# Altium schematic sheet cs301_Group2_Sensing.SchDoc
size A4; SheetNumber: 2; SheetTotal: 3
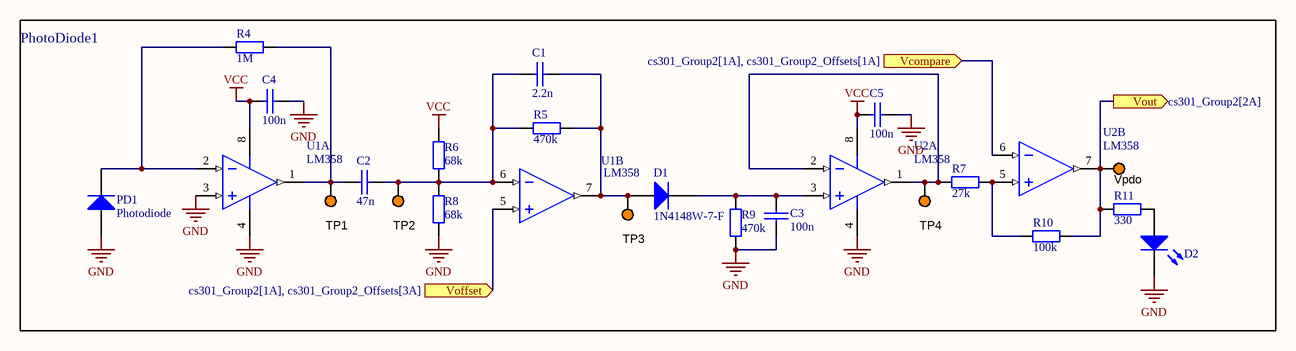
[diagram p0: cs301_Group2_Sensing.SchDoc]

## Parts
C1  2.2n  [0805 CAP]
C2  47n  [0805 CAP]
C3  100n  [0805 CAP]
C4  100n  [0805 CAP]
C5  100n  [0805 CAP]
D1  1N4148W-7-F  [SOD123]
D2  LTST-C170KGKT  [0805 LED]  (value not drawn)
PD1  Photodiode  [SOD123]
R4  1M  [0805 RES]
R5  470k  [0805 RES]
R6  68k  [0805 RES]
R7  27k  [0805 RES]
R8  68k  [0805 RES]
R9  470k  [0805 RES]
R10  100k  [0805 RES]
R11  330  [0805 RES]
TP1  5003  [TP_TH]  (value not drawn)
TP2  5003  [TP_TH]  (value not drawn)
TP3  5003  [TP_TH]  (value not drawn)
TP4  5003  [TP_TH]  (value not drawn)
U1  LM358  [SO - 8]  (parts A,B of 2)
U2  LM358  [SO - 8]  (parts A,B of 2)
Vpdo  5003  [TP_TH]  (value not drawn)

## Blocks framed on the sheet
PhotoDiode1: C1-C5 D1 D2 PD1 R4-R11 TP1-TP4 U1 U2 Vpdo

## Ports
Vcompare (in, see cs301_Group2[1A], cs301_Group2_Offsets[1A]), Voffset (in, see cs301_Group2[1A], cs301_Group2_Offsets[3A]), Vout (out, see cs301_Group2[2A])

## Nets
GND: C3.1 C4.2 C5.2 D2.2(K) PD1.1(A) R8.1 R9.1 U1.3(VINA+) U1.4(VSS) U2.4(VSS)
VCC: C4.1 C5.1 R6.2 U1.8(VDD) U2.8(VDD)
Vcompare: U2.6(VINA-) ; port Vcompare
Voffset: U1.5(VINA+) ; port Voffset
Vout: R10.1 R11.1 U2.7(VOUTA) Vpdo.1 ; port Vout
NetC1_1: C1.1 C2.2 R5.2 R6.1 R8.2 TP2.1 U1.6(VINA-)
NetC1_2: C1.2 D1.1(A) R5.1 TP3.1 U1.7(VOUTA)
NetC2_1: C2.1 R4.1 TP1.1 U1.1(VOUTA)
NetC3_2: C3.2 D1.2(K) R9.2 U2.3(VINA+)
NetD2_1: D2.1(A) R11.2
NetPD1_2: PD1.2(K) R4.2 U1.2(VINA-)
NetR7_1: R7.1 R10.2 U2.5(VINA+)
NetR7_2: R7.2 TP4.1 U2.1(VOUTA) U2.2(VINA-)

## Library data of the parts
C1-C5 = CerCap_SMT_0805: SMT ceramic capacitor 0805 size; Value: *
D1 = ES1H_SMT_DO214: 1N4148 100V 200mA SOD-123 diode; Manufacturer: ON Semiconductor; Manufacturer Part Number: 1N4148TR; Diode Type: Standard; Speed: Small Signal =< 200mA (Io), Any Speed; Capacitance @ Vr, F: 4pF @ 0V, 1MHz; Supplier 1: Digi-Key; RoHS: RoHS Compliant; Category: Discrete Semiconductor Products; Stock 1: 1658049; Pricing 1: 1=0.16, 10=0.109, 100=0.0592, 500=0.03648, 1000=0.02488 (NZD); Part Status: Active; Current - Average Rectified (Io): 200mA; Mounting Type: Through Hole; Package / Case: DO-204AH, DO-35, Axial; Supplier Device Package: DO-35; Operating Temperature - Junction: -65°C ~ 175°C; Base Part Number: 1N4148; ComponentLink1URL: https://www.fairchildsemi.com/datasheets/1N/1N914.pdf; ComponentLink1Description: https://www.fairchildsemi.com/datasheets/1N/1N914.pdf; Supplier Part Number 1: 1N4148FSCT-ND
D2 = LED_SMT_0805: SMT LED 0805 size; Manufacturer: Lite-On Inc.; Color: Green; Lens Color: Colorless; Lens Transparency: Clear; Millicandela Rating: 35mcd; Lens Style/Size: Rectangle with Flat Top, 1.40mm x 1.25mm; Voltage - Forward (Vf) (Typ): 2V; Current - Test: 20mA; Viewing Angle: 130°; Wavelength - Dominant: 571nm; Wavelength - Peak: 574nm; Supplier 1: Digi-Key; Manufacturer Part Number: LTST-C170KGKT; RoHS: RoHS Compliant; Category: Optoelectronics; Stock 1: 503069; Pricing 1: 1=0.62, 10=0.459, 25=0.338, 100=0.2415, 250=0.16416, 500=0.14486, 1000=0.11347 (NZD); Packaging: Cut Tape (CT); Part Status: Active; Mounting Type: Surface Mount; Features: -; Package / Case: 0805 (2012 Metric); Size / Dimension: 2.00mm L x 1.25mm W; Height (Max): 1.10mm; ComponentLink1URL: http://optoelectronics.liteon.com/upload/download/DS22-2000-073/LTST-C170KGKT.pdf; ComponentLink1Description: http://optoelectronics.liteon.com/upload/download/DS22-2000-073/LTST-C170KGKT.pdf; Supplier Part Number 1: 160-1414-1-ND
PD1 = 1N4148_SMT_SOD123: DIODE GEN PURP 100V 300MA SOD123; Manufacturer: Diodes Incorporated; Manufacturer Part Number: 1N4148W-13-F; Diode Type: Standard; Current - Average Rectified (Io): 150mA; Speed: Small Signal =< 200mA (Io), Any Speed; Capacitance @ Vr, F: 2pF @ 0V, 1MHz; Supplier 1: Digi-Key; RoHS: RoHS Compliant; Category: Discrete Semiconductor Products; Stock 1: 5282; Pricing 1: 1=0.33, 10=0.292, 100=0.1586, 500=0.0976, 1000=0.06656 (NZD); Packaging: Cut Tape (CT); Part Status: Active; Mounting Type: Surface Mount; Package / Case: SOD-123; Supplier Device Package: SOD-123; Operating Temperature - Junction: -65°C ~ 150°C; Base Part Number: 1N4148W; ComponentLink1URL: https://www.diodes.com/assets/Datasheets/ds30086.pdf; ComponentLink1Description: https://www.diodes.com/assets/Datasheets/ds30086.pdf; Supplier Part Number 1: 1N4148W-13FDICT-ND
R4-R11 = Res_SMT_0805: 0805 resistor; Published: 8-Jun-2000; LatestRevisionDate: 17-Jul-2002; LatestRevisionNote: Re-released for DXP Platform.; PackageReference: AXIAL-0.4; Publisher: Altium Limited; Value: *; ComponentLink1Description: https://nz.mouser.com/datasheet/2/315/AOA0000C304-1149620.pdf
TP1-TP4 Vpdo = TestPoint: Test Point, Orange, 1-Pin THD, RoHS; Peak Reverse Current: 600 uA; Forward Current: 3 A; Max Surge Current: 80 A; Forward Voltage: 1.08 V; Max Operating Temperature: 150 degC; PackageReference: 5003; Pins: 2; ComponentLink2URL: http://keyelco.com/userAssets/file/M65p56.pdf; PackageDescription: 1-Pin Through Hole Device, Dia 2.54 mm; Weight: 0.01 lb; Diameter: 5.3 mm; Mount: Through Hole; Package Quantity: 500; Packaging: Bulk; Min Operating Temperature: -65 degC; ComponentLink1Description: Manufacturer URL; Height: 0.25 inch; ComponentLink1URL: http://www.keyelco.com/; ComponentLink2Description: Datasheet; Width: 0.25 inch; REACH SVHC: No SVHC; RoHSCompliant: true; Radiation Hardening: No; Length: 9.5 mm; DatasheetVersion: Jun-15
U1 U2 = LM358_SMT_SOIC8: IC OPAMP 8SOIC; ComponentLink1URL: http://www.ti.com/lit/ds/symlink/tlc080a.pdf; ComponentLink1Description: http://www.ti.com/lit/ds/symlink/tlc080a.pdf; Supplier 1: Digi-Key; Supplier Part Number 1: 296-1014-1-ND